# Altium schematic sheet Analogicas_Tension.SchDoc: Analogicas Tension
size A3; CompanyName: TM; DrawnBy: Juan Tinazzo; SheetNumber: 4; SheetTotal: 7; Number: CB_AT; Company: TM
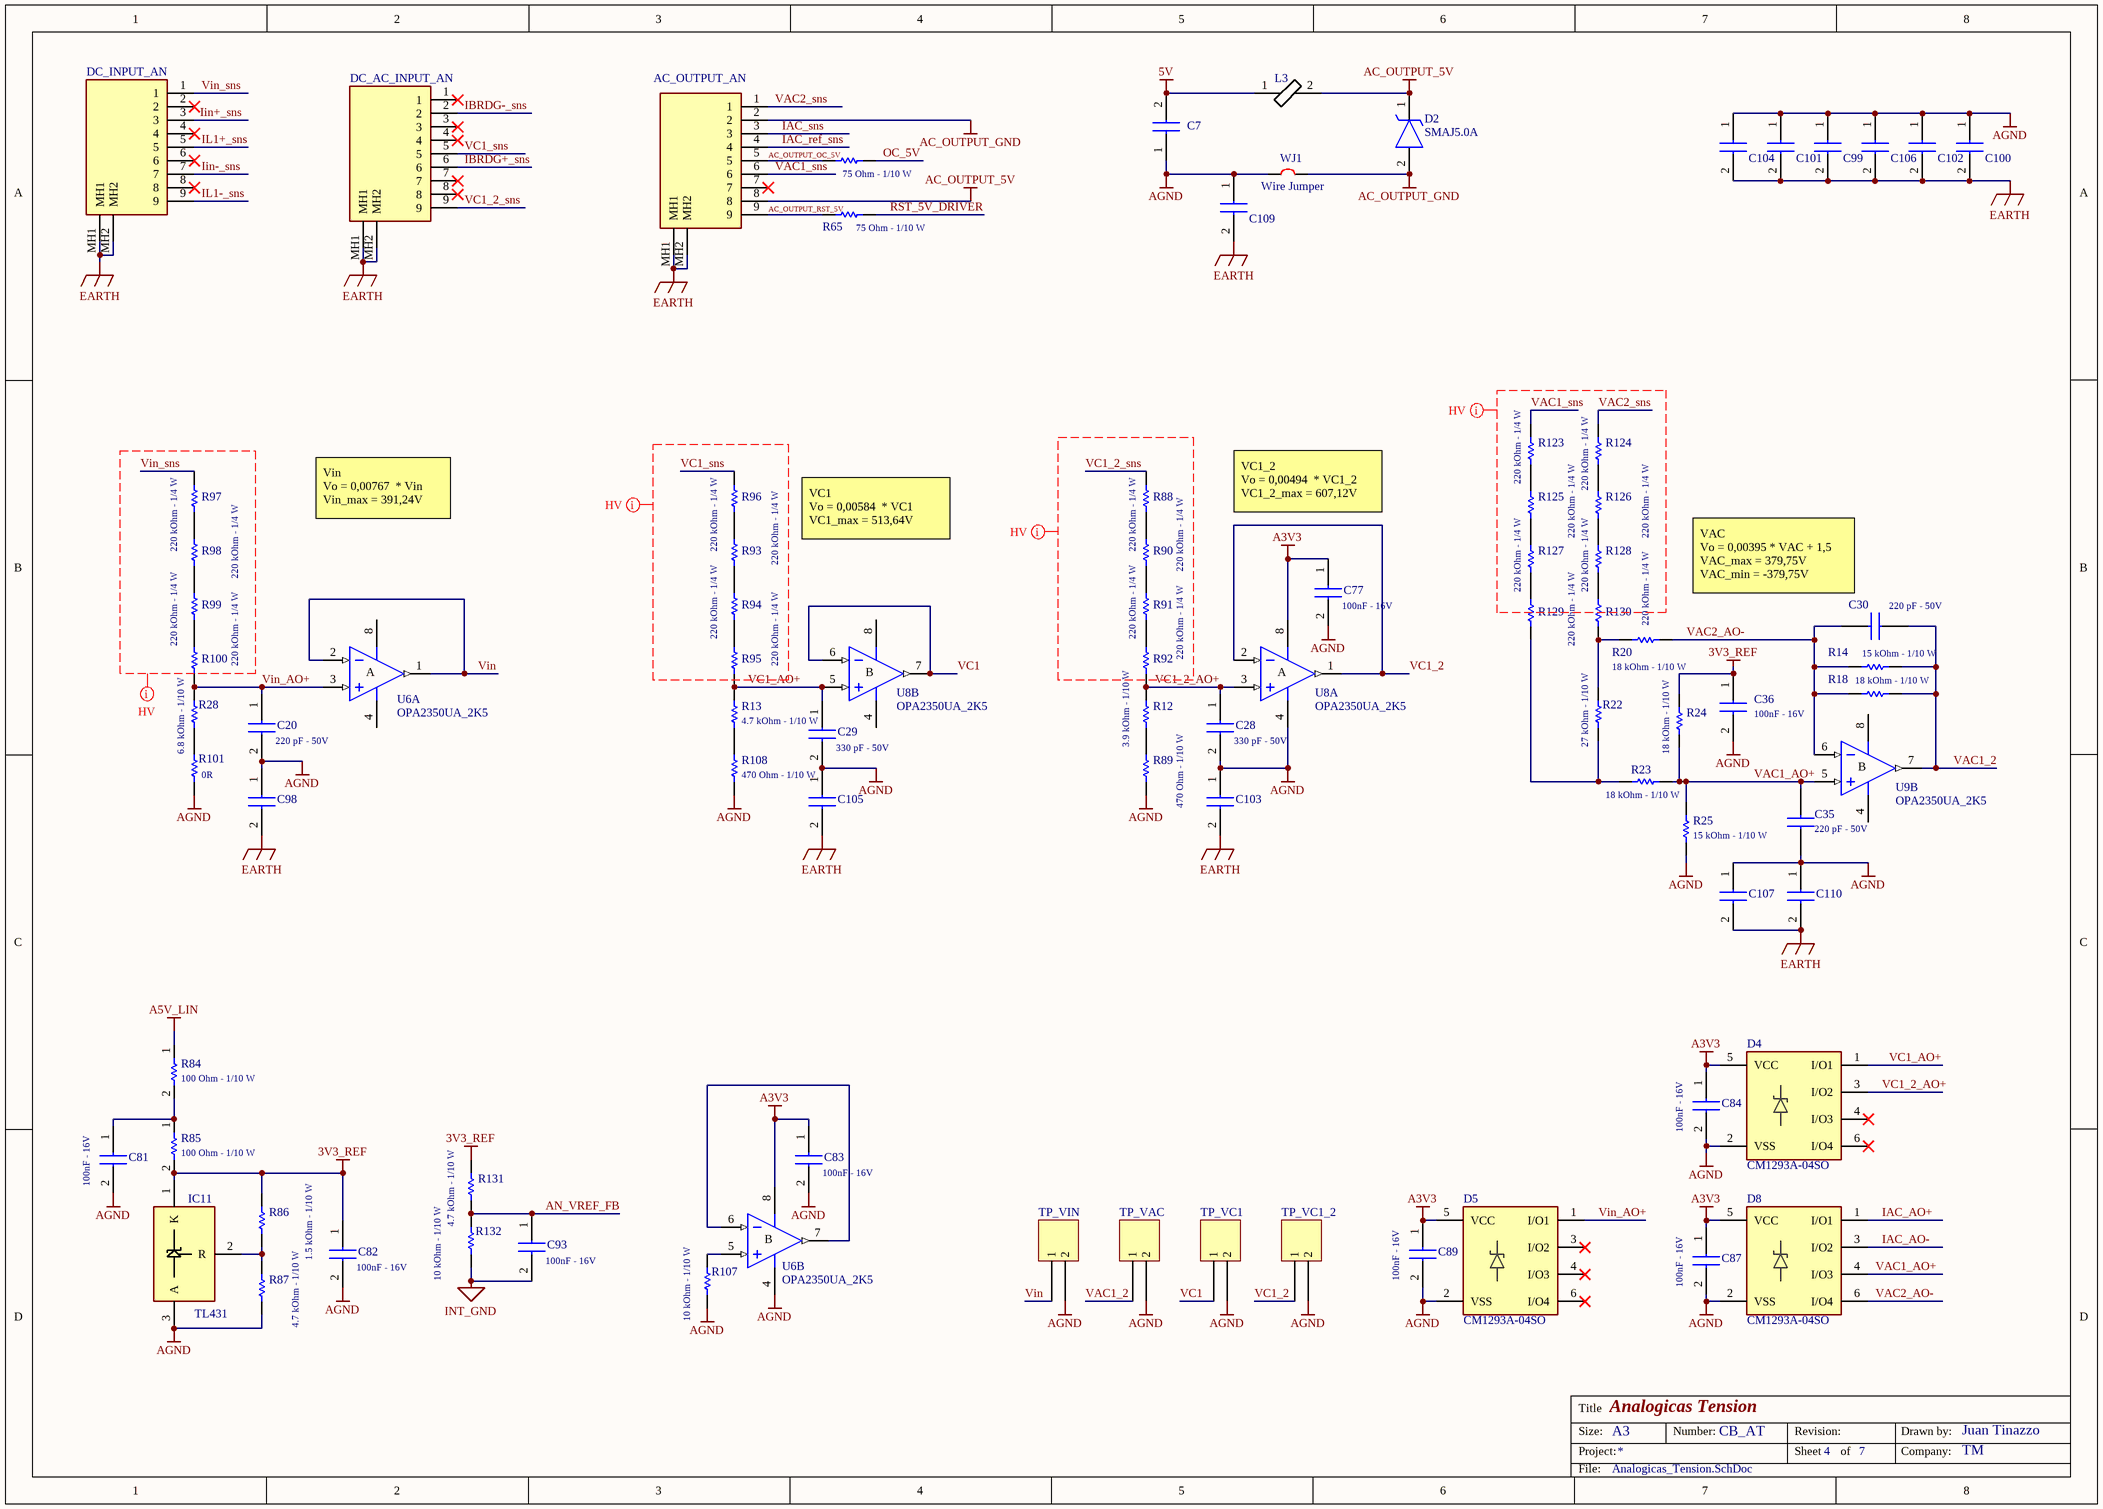
[diagram p0: Analogicas_Tension.SchDoc]

## Parts
AC_OUTPUT_AN  L77TSEH09SOL2RM8  [L77TSEH09SOL2RM8]  (value not drawn)
C7  CL21B105KAFNNNG  [CAPC2012X135N]  (value not drawn)
C20  value 220 pF - 50V  [C0603]  (hidden comment: 220p 50V 5% 0603)
C28  value 330 pF - 50V  [C0603]  (hidden comment: C0603C331J5GACAUTO)
C29  value 330 pF - 50V  [C0603]  (hidden comment: C0603C331J5GACAUTO)
C30  value 220 pF - 50V  [C0603]  (hidden comment: C0603C221J5HACAUTO)
C35  value 220 pF - 50V  [C0603]  (hidden comment: C0603C221J5HACAUTO)
C36  value 100nF - 16V  [CAPC1608X95N]  (hidden comment: 100n 16V 0603)
C77  value 100nF - 16V  [CAPC1608X95N]  (hidden comment: 100n 16V 0603)
C81  value 100nF - 16V  [CAPC1608X95N]  (hidden comment: 100n 16V 0603)
C82  value 100nF - 16V  [CAPC1608X95N]  (hidden comment: 100n 16V 0603)
C83  value 100nF - 16V  [CAPC1608X95N]  (hidden comment: 100n 16V 0603)
C84  value 100nF - 16V  [CAPC1608X95N]  (hidden comment: 100n 16V 0603)
C87  value 100nF - 16V  [CAPC1608X95N]  (hidden comment: 100n 16V 0603)
C89  value 100nF - 16V  [CAPC1608X95N]  (hidden comment: 100n 16V 0603)
C93  value 100nF - 16V  [CAPC1608X95N]  (hidden comment: 100n 16V 0603)
C98  LDEQD1100KA5N00  [C_2220_1206]  (value not drawn)
C99  C1206C102KGRACAUTO  [C1206]  (value not drawn)
C100  C1206C102KGRACAUTO  [C1206]  (value not drawn)
C101  C1206C102KGRACAUTO  [C1206]  (value not drawn)
C102  C1206C102KGRACAUTO  [C1206]  (value not drawn)
C103  LDEQD1100KA5N00  [C_2220_1206]  (value not drawn)
C104  C1206C102KGRACAUTO  [C1206]  (value not drawn)
C105  LDEQD1100KA5N00  [C_2220_1206]  (value not drawn)
C106  C1206C102KGRACAUTO  [C1206]  (value not drawn)
C107  LDEQD1100KA5N00  [C_2220_1206]  (value not drawn)
C109  LDEQD1100KA5N00  [C_2220_1206]  (value not drawn)
C110  LDEQD1100KA5N00  [C_2220_1206]  (value not drawn)
D2  SMAJ5.0A  [DIOM5026X229N]
D4  CM1293A-04SO  [SOT95P275X110-6N]
D5  CM1293A-04SO  [SOT95P275X110-6N]
D8  CM1293A-04SO  [SOT95P275X110-6N]
DC_AC_INPUT_AN  L77TSEH09SOL2RM8  [L77TSEH09SOL2RM8]  (value not drawn)
DC_INPUT_AN  L77TSEH09SOL2RM8  [L77TSEH09SOL2RM8]  (value not drawn)
IC11  TL431  [SOT95P237X112-3N]
L3  78279220601  [BEADC2012X110N]  (value not drawn)
R12  value 3.9 kOhm - 1/10 W  [RESC1608X50N]  (hidden comment: CRCW06033K90FKEA)
R13  value 4.7 kOhm - 1/10 W  [RESC1608X50N]  (hidden comment: CRCW06034K70FKEAHP)
R14  value 15 kOhm - 1/10 W  [RESC1608X55N]  (hidden comment: CRCW060315K0FKEAC)
R18  value 18 kOhm - 1/10 W  [RESC1608X50N]  (hidden comment: CRCW060318K0FKEA)
R20  value 18 kOhm - 1/10 W  [RESC1608X50N]  (hidden comment: CRCW060318K0FKEA)
R22  value 27 kOhm - 1/10 W  [RESC1608X55N]  (hidden comment: CRCW060327K0FKEAC)
R23  value 18 kOhm - 1/10 W  [RESC1608X50N]  (hidden comment: CRCW060318K0FKEA)
R24  value 18 kOhm - 1/10 W  [RESC1608X50N]  (hidden comment: CRCW060318K0FKEA)
R25  value 15 kOhm - 1/10 W  [RESC1608X55N]  (hidden comment: CRCW060315K0FKEAC)
R28  value 6.8 kOhm - 1/10 W  [RESC1608X50N]  (hidden comment: CRCW06036K80FKEA)
R62  value 75 Ohm - 1/10 W  [RESC1608X55N]  (hidden comment: CRCW060375R0FKEAC)
R65  value 75 Ohm - 1/10 W  [RESC1608X55N]  (hidden comment: CRCW060375R0FKEAC)
R84  value 100 Ohm - 1/10 W  [RESC1608X55N]  (hidden comment: CRCW0603100RFKEBC)
R85  value 100 Ohm - 1/10 W  [RESC1608X55N]  (hidden comment: CRCW0603100RFKEBC)
R86  value 1.5 kOhm - 1/10 W  [RESC1608X50N]  (hidden comment: CRCW06031K50FKEA)
R87  value 4.7 kOhm - 1/10 W  [RESC1608X50N]  (hidden comment: CRCW06034K70FKEAHP)
R88  value 220 kOhm - 1/4 W  [RESC3216X60N]  (hidden comment: CRCW1206220KFKEA)
R89  value 470 Ohm - 1/10 W  [RESC1608X50N]  (hidden comment: CRCW0603470RFKEA)
R90  value 220 kOhm - 1/4 W  [RESC3216X60N]  (hidden comment: CRCW1206220KFKEA)
R91  value 220 kOhm - 1/4 W  [RESC3216X60N]  (hidden comment: CRCW1206220KFKEA)
R92  value 220 kOhm - 1/4 W  [RESC3216X60N]  (hidden comment: CRCW1206220KFKEA)
R93  value 220 kOhm - 1/4 W  [RESC3216X60N]  (hidden comment: CRCW1206220KFKEA)
R94  value 220 kOhm - 1/4 W  [RESC3216X60N]  (hidden comment: CRCW1206220KFKEA)
R95  value 220 kOhm - 1/4 W  [RESC3216X60N]  (hidden comment: CRCW1206220KFKEA)
R96  value 220 kOhm - 1/4 W  [RESC3216X60N]  (hidden comment: CRCW1206220KFKEA)
R97  value 220 kOhm - 1/4 W  [RESC3216X60N]  (hidden comment: CRCW1206220KFKEA)
R98  value 220 kOhm - 1/4 W  [RESC3216X60N]  (hidden comment: CRCW1206220KFKEA)
R99  value 220 kOhm - 1/4 W  [RESC3216X60N]  (hidden comment: CRCW1206220KFKEA)
R100  value 220 kOhm - 1/4 W  [RESC3216X60N]  (hidden comment: CRCW1206220KFKEA)
R101  value 0R  [RESC1608X55N]  (hidden comment: CRCW06030000Z0EBC)
R107  value 10 kOhm - 1/10 W  [RESC1608X50N]  (hidden comment: CRCW060310K0FKEA)
R108  value 470 Ohm - 1/10 W  [RESC1608X50N]  (hidden comment: CRCW0603470RFKEA)
R123  value 220 kOhm - 1/4 W  [RESC3216X60N]  (hidden comment: CRCW1206220KFKEA)
R124  value 220 kOhm - 1/4 W  [RESC3216X60N]  (hidden comment: CRCW1206220KFKEA)
R125  value 220 kOhm - 1/4 W  [RESC3216X60N]  (hidden comment: CRCW1206220KFKEA)
R126  value 220 kOhm - 1/4 W  [RESC3216X60N]  (hidden comment: CRCW1206220KFKEA)
R127  value 220 kOhm - 1/4 W  [RESC3216X60N]  (hidden comment: CRCW1206220KFKEA)
R128  value 220 kOhm - 1/4 W  [RESC3216X60N]  (hidden comment: CRCW1206220KFKEA)
R129  value 220 kOhm - 1/4 W  [RESC3216X60N]  (hidden comment: CRCW1206220KFKEA)
R130  value 220 kOhm - 1/4 W  [RESC3216X60N]  (hidden comment: CRCW1206220KFKEA)
R131  value 4.7 kOhm - 1/10 W  [RESC1608X50N]  (hidden comment: CRCW06034K70FKEAHP)
R132  value 10 kOhm - 1/10 W  [RESC1608X50N]  (hidden comment: CRCW060310K0FKEA)
TP_VAC  Test_Point  [Test Point]  (value not drawn)
TP_VC1  Test_Point  [Test Point]  (value not drawn)
TP_VC1_2  Test_Point  [Test Point]  (value not drawn)
TP_VIN  Test_Point  [Test Point]  (value not drawn)
U6  OPA2350UA_2K5  [SOIC127P600X175-8N]  (parts A,B of 2)
U8  OPA2350UA_2K5  [SOIC127P600X175-8N]  (parts A,B of 2)
U9  OPA2350UA_2K5  [SOIC127P600X175-8N]  (part B of 2)
WJ1  Wire Jumper  (net tie, no BOM)

## Nets
3V3_REF: C36.1 C82.1 IC11.1(K) R24.2 R85.2 R86.1 R131.1
5V: C7.2 L3.1
A3V3: C77.1 C83.1 C84.1 C87.1 C89.1 D4.5(VCC) D5.5(VCC) D8.5(VCC) U6.8(V+) U8.8(V+)
A5V_LIN: R84.1
AC_OUTPUT_5V: AC_OUTPUT_AN.8 D2.1(K) L3.2
AC_OUTPUT_GND: AC_OUTPUT_AN.2 D2.2(A) WJ1.1
AGND: C7.1 C20.2 C28.2 C29.2 C35.2 C36.2 C77.2 C81.2 C82.2 C83.2 C84.2 C87.2 C89.2 C98.1 C99.1 C100.1 C101.1 C102.1 C103.1 C104.1 C105.1 C106.1 C107.1 C109.1 C110.1 D4.2(VSS) D5.2(VSS) D8.2(VSS) IC11.3(A) R25.2 R87.2 R89.2 R101.1 R107.1 R108.2 TP_VAC.2 TP_VC1.2 TP_VC1_2.2 TP_VIN.2 U6.4(V-) U8.4(V-) WJ1.0
EARTH: AC_OUTPUT_AN.MH1 AC_OUTPUT_AN.MH2 C98.2 C99.2 C100.2 C101.2 C102.2 C103.2 C104.2 C105.2 C106.2 C107.2 C109.2 C110.2 DC_AC_INPUT_AN.MH1 DC_AC_INPUT_AN.MH2 DC_INPUT_AN.MH1 DC_INPUT_AN.MH2
INT_GND: C93.2 R132.2
AC_OUTPUT_OC_5V: AC_OUTPUT_AN.5 R62.1
AC_OUTPUT_RST_5V: AC_OUTPUT_AN.9 R65.1
AN_VREF_FB: C93.1 R131.2 R132.1
IAC_AO+: D8.1(I/O1)
IAC_AO-: D8.3(I/O2)
IAC_ref_sns: AC_OUTPUT_AN.4
IAC_sns: AC_OUTPUT_AN.3
IBRDG+_sns: DC_AC_INPUT_AN.6
IBRDG-_sns: DC_AC_INPUT_AN.2
Iin+_sns: DC_INPUT_AN.3
Iin-_sns: DC_INPUT_AN.7
IL1+_sns: DC_INPUT_AN.5
IL1-_sns: DC_INPUT_AN.9
OC_5V: R62.2
RST_5V_DRIVER: R65.2
VAC1_2: C30.1 R14.2 R18.2 TP_VAC.1 U9.7(OUT)
VAC1_AO+: C35.1 D8.4(I/O3) R23.1 R24.1 R25.1 U9.5(IN+)
VAC1_sns: AC_OUTPUT_AN.6 R123.2
VAC2_AO-: C30.2 D8.6(I/O4) R14.1 R18.1 R20.1 U9.6(IN-)
VAC2_sns: AC_OUTPUT_AN.1 R124.2
VC1: TP_VC1.1 U8.6(IN-) U8.7(OUT)
VC1_2: TP_VC1_2.1 U8.1(OUT) U8.2(IN-)
VC1_2_AO+: C28.1 D4.3(I/O2) R12.2 R92.1 U8.3(IN+)
VC1_2_sns: DC_AC_INPUT_AN.9 R88.2
VC1_AO+: C29.1 D4.1(I/O1) R13.2 R95.1 U8.5(IN+)
VC1_sns: DC_AC_INPUT_AN.5 R96.2
Vin: TP_VIN.1 U6.1(OUT) U6.2(IN-)
Vin_AO+: C20.1 D5.1(I/O1) R28.2 R100.1 U6.3(IN+)
Vin_sns: DC_INPUT_AN.1 R97.2
NetC81_1: C81.1 R84.2 R85.1
NetIC11_2: IC11.2(R) R86.2 R87.1
NetR12_1: R12.1 R89.1
NetR13_1: R13.1 R108.1
NetR20_2: R20.2 R22.2 R130.1
NetR22_1: R22.1 R23.2 R129.1
NetR28_1: R28.1 R101.2
NetR88_1: R88.1 R90.2
NetR90_1: R90.1 R91.2
NetR91_1: R91.1 R92.2
NetR93_1: R93.1 R94.2
NetR93_2: R93.2 R96.1
NetR94_1: R94.1 R95.2
NetR97_1: R97.1 R98.2
NetR98_1: R98.1 R99.2
NetR99_1: R99.1 R100.2
NetR107_2: R107.2 U6.5(IN+)
NetR123_1: R123.1 R125.2
NetR124_1: R124.1 R126.2
NetR125_1: R125.1 R127.2
NetR126_1: R126.1 R128.2
NetR127_1: R127.1 R129.2
NetR128_1: R128.1 R130.2
NetU6_6: U6.6(IN-) U6.7(OUT)

Not connected (* = marked no-connect by the designer): AC_OUTPUT_AN 7*; D4 4(I/O3)* 6(I/O4)*; D5 3(I/O2)* 4(I/O3)* 6(I/O4)*; DC_AC_INPUT_AN 1* 3* 4* 7* 8*; DC_INPUT_AN 2* 4* 6* 8*; U9 4(V-) 8(V+)

## Layout directives
net class HV_track: VAC1_sns, VAC2_sns, VC1_2_sns, VC1_sns, Vin_sns

## Notes on the sheet
- Vin
  Vo = 0,00767  * Vin
  Vin_max = 391,24V
- VC1_2
  Vo = 0,00494  * VC1_2
  VC1_2_max = 607,12V
- VC1
  Vo = 0,00584  * VC1
  VC1_max = 513,64V
- VAC
  Vo = 0,00395 * VAC + 1,5
  VAC_max = 379,75V
  VAC_min = -379,75V
- Title
- Size:
- Project:
- A3
- Number:
- Revision:
- Sheet
- of
- Drawn by:
- Company:
- File:
- (in symbol OPA2350UA_2K5, part A) A
- (in symbol OPA2350UA_2K5, part B) B

## Library data of the parts
AC_OUTPUT_AN DC_AC_INPUT_AN DC_INPUT_AN = L77TSEH09SOL2RM8: Connector; Manufacturer_Name: Amphenol Communications Solutions; Value: Conectores estándar subminiatura D D-SUB; Datasheet Link: https://cdn.amphenol-cs.com/media/wysiwyg/files/drawing/l77tsxhxxsol2rm8.pdf; Height: 12.3mm; Manufacturer_Part_Number: L77TSEH09SOL2RM8; Mouser Part Number: 523-L77TSEH09SOL2RM8; Mouser Price/Stock: https://www.mouser.co.uk/ProductDetail/Amphenol-Commercial-Products/L77TSEH09SOL2RM8?qs=mq7kV%2Fq8lk5RvjourI%2Fduw%3D%3D; Arrow Part Number: L77TSEH09SOL2RM8; Arrow Price/Stock: https://www.arrow.com/en/products/l77tseh09sol2rm8/amphenol-fci?region=nac; System: Connector
C7 = CL21B105KAFNNNG: Capacitor; Manufacturer_Name: SAMSUNG; Value: 1 uF - 25 V; Datasheet Link: https://datasheet.datasheetarchive.com/originals/distributors/Datasheets-DGA8/2478773.pdf; Height: 1.35mm; Manufacturer_Part_Number: CL21B105KAFNNNG; Mouser Part Number: 187-CL21B105KAFNNNG; Mouser Price/Stock: https://www.mouser.co.uk/ProductDetail/Samsung-Electro-Mechanics/CL21B105KAFNNNG?qs=yOVawPpwOwmXkU%252BG0TK%2F5g%3D%3D; Arrow Part Number: CL21B105KAFNNNG; Arrow Price/Stock: https://www.arrow.com/en/products/cl21b105kafnnng/samsung-electro-mechanics?region=europe
C20 C30 C35 = C0603C221J5HACAUTO: Capacitor; Manufacturer_Name: KEMET; Datasheet Link: https://content.kemet.com/datasheets/KEM_C1007_X8R_ULTRA_150C_SMD.pdf; Height: 0.87mm; Manufacturer_Part_Number: C0603C221J5HACAUTO; Mouser Part Number: 80-C0603C221J5HAUTO; Mouser Price/Stock: https://www.mouser.co.uk/ProductDetail/KEMET/C0603C221J5HACAUTO?qs=j%252B1pi9TdxUZayjzZ3rh80g%3D%3D
C28 C29 = C0603C331J5GACAUTO: Capacitor; Manufacturer_Name: KEMET; Datasheet Link: https://content.kemet.com/datasheets/KEM_C1022_C0G_AUTO_SMD.pdf; Height: 0.87mm; Manufacturer_Part_Number: C0603C331J5GACAUTO; Mouser Part Number: 80-C0603C331J5GAUTO
C36 C77 C81-C84 C87 C89 C93 = EMK107B7104KA-T: Capacitor; Manufacturer_Name: TAIYO YUDEN; Datasheet Link: http://www.farnell.com/datasheets/746258.pdf; Height: 0.95mm; Manufacturer_Part_Number: EMK107B7104KA-T; Mouser Part Number: 963-EMK107B7104KA-T; Arrow Part Number: EMK107B7104KA-T; Arrow Price/Stock: https://www.arrow.com/en/products/emk107b7104ka-t/taiyo-yuden
  C36: Mouser Price/Stock: https://www.mouser.co.uk/ProductDetail/TAIYO-YUDEN/EMK107B7104KA-T?qs=I6KAKw0tg2ybqzX8hKPgfw%3D%3D
  C77 C81-C84 C87 C89 C93: Mouser Price/Stock: https://www.mouser.co.uk/ProductDetail/Taiyo-Yuden/EMK107B7104KA-T?qs=I6KAKw0tg2ybqzX8hKPgfw%3D%3D
C98 C103 C105 C107 C109 C110 = LDEQD1100KA5N00: Capacitor; Manufacturer_Name: KEMET; Value: 1nF - 1000V; Datasheet Link: https://content.kemet.com/datasheets/KEM_F3078_LDE.pdf; Height: 1.9mm; Manufacturer_Part_Number: LDEQD1100KA5N00; Mouser Part Number: 80-LDEQD1100KA5N00; Mouser Price/Stock: https://www.mouser.co.uk/ProductDetail/KEMET/LDEQD1100KA5N00?qs=MdJgNetHbfkxq2yA6XdGCw%3D%3D
C99-C102 C104 C106 = C1206C102KGRACAUTO: Capacitor; Manufacturer_Name: KEMET; Value: 1nF - 2000V; Datasheet Link: https://content.kemet.com/datasheets/KEM_C1076_X7R_HV_AUTO_SMD.pdf; Manufacturer_Part_Number: C1206C102KGRACAUTO; Mouser Part Number: 80-C1206C102KGRAUTO; Mouser Price/Stock: https://www.mouser.co.uk/ProductDetail/KEMET/C1206C102KGRACAUTO?qs=02kMkzikyGKenJNcwYLRQw%3D%3D; Arrow Part Number: C1206C102KGRACAUTO; Arrow Price/Stock: https://www.arrow.com/en/products/c1206c102kgracauto/kemet-corporation?region=nac
D2 = SMAJ5.0A: TVS Diode (Uni-directional); Manufacturer_Name: LITTELFUSE; Value: 1CH - Unidireccional - 5V - 3.3 W; Datasheet Link: https://www.littelfuse.com/~/media/electronics/datasheets/tvs_diodes/littelfuse_tvs_diode_smaj_datasheet.pdf.pdf; Height: 2.29mm; Manufacturer_Part_Number: SMAJ5.0A; Mouser Part Number: 576-SMAJ5.0A; Mouser Price/Stock: https://www.mouser.co.uk/ProductDetail/Littelfuse/SMAJ5.0A?qs=2VFNtWizgicfetZVA4gWHA%3D%3D; Arrow Part Number: SMAJ5.0A; Arrow Price/Stock: https://www.arrow.com/en/products/smaj5.0a/littelfuse?region=europe
D4 D5 D8 = CM1293A-04SO: TVS Diode (Bi-directional); Manufacturer_Name: onsemi; Manufacturer_Part_Number: D5V0P4UR6SO-7; Value: 4CH - Unidireccional - 3.3V - 800mW; Datasheet Link: https://www.onsemi.com/pub/Collateral/CM1293A-04SO-D.PDF; Height: 1.1mm; Mouser Part Number: 748-CM1293A-04SO; Mouser Price/Stock: https://www.mouser.co.uk/ProductDetail/onsemi/CM1293A-04SO?qs=LMMkZCEv%2Ff0mlcOKTEwKBg%3D%3D; Arrow Part Number: CM1293A-04SO; Arrow Price/Stock: https://www.arrow.com/en/products/cm1293a-04so/on-semiconductor?region=nac
IC11 = TL431LIBEDBZRQ1: Integrated Circuit; Manufacturer_Name: Texas Instruments; Value: Referencias de voltaje; Datasheet Link: https://www.ti.com/lit/gpn/TL431LI-Q1; Height: 1.12mm; Manufacturer_Part_Number: TL431LIBEDBZRQ1; Mouser Part Number: 595-TL431LIBEDBZRQ1; Mouser Price/Stock: https://www.mouser.co.uk/ProductDetail/Texas-Instruments/TL431LIBEDBZRQ1?qs=Cb2nCFKsA8oDEduucTTYNA%3D%3D; Arrow Part Number: TL431LIBEDBZRQ1; Arrow Price/Stock: https://www.arrow.com/en/products/tl431libedbzrq1/texas-instruments?region=nac
L3 = 78279220601: Ferrite Bead; Manufacturer_Name: Wurth Elektronik; Value: Núcleos de ferrita WE-MPSA EMI 600Ohms 2.1A 80mOhms; Datasheet Link: https://www.mouser.de/datasheet/2/445/78279220601-2298574.pdf; Height: 1.1mm; Manufacturer_Part_Number: 78279220601; Mouser Part Number: 710-78279220601; Mouser Price/Stock: https://www.mouser.co.uk/ProductDetail/Wurth-Elektronik/78279220601?qs=iLbezkQI%252BsjgiK1FovJqGg%3D%3D
R12 = CRCW06033K90FKEA: Resistor; Manufacturer_Name: Vishay; Datasheet Link: http://www.vishay.com/docs/20035/dcrcwe3.pdf; Height: 0.5mm; Manufacturer_Part_Number: CRCW06033K90FKEA; Mouser Part Number: 71-CRCW0603-3.9K-E3; Mouser Price/Stock: https://www.mouser.com/Search/Refine.aspx?Keyword=71-CRCW0603-3.9K-E3; Arrow Part Number: CRCW06033K90FKEA; Arrow Price/Stock: https://www.arrow.com/en/products/crcw06033k90fkea/vishay
R13 R87 R131 = CRCW06034K70FKEAHP: Resistor; Manufacturer_Name: Vishay; Datasheet Link: http://www.farnell.com/datasheets/1885357.pdf; Height: 0.5mm; Manufacturer_Part_Number: CRCW06034K70FKEAHP; Mouser Part Number: 71-CRCW06034K70FKEAH; Mouser Price/Stock: https://www.mouser.co.uk/ProductDetail/Vishay-Dale/CRCW06034K70FKEAHP?qs=k2%2FDWSARqgF9tclCHvhGkQ%3D%3D; Arrow Part Number: CRCW06034K70FKEAHP; Arrow Price/Stock: https://www.arrow.com/en/products/crcw06034k70fkeahp/vishay?region=nac
R14 R25 = CRCW060315K0FKEAC: Resistor; Manufacturer_Name: Vishay; Datasheet Link: https://www.arrow.com/en/products/crcw060315k0fkeac/vishay; Height: 0.55mm; Manufacturer_Part_Number: CRCW060315K0FKEAC; Mouser Part Number: 71-CRCW060315K0FKEAC; Mouser Price/Stock: https://www.mouser.co.uk/ProductDetail/Vishay-Dale/CRCW060315K0FKEAC?qs=E3Y5ESvWgWOCeZLgjE8pIw%3D%3D; Arrow Part Number: CRCW060315K0FKEAC; Arrow Price/Stock: https://www.arrow.com/en/products/crcw060315k0fkeac/vishay?region=nac
R18 R20 R23 R24 = CRCW060318K0FKEA: Resistor; Manufacturer_Name: Vishay; Datasheet Link: http://www.vishay.com/docs/20035/dcrcwe3.pdf; Height: 0.5mm; Manufacturer_Part_Number: CRCW060318K0FKEA; Mouser Part Number: 71-CRCW0603-18K-E3; Mouser Price/Stock: https://www.mouser.co.uk/ProductDetail/Vishay-Dale/CRCW060318K0FKEA?qs=Ihd9YkxhV%2F2Qiuqr%2FyuzaQ%3D%3D; Arrow Part Number: CRCW060318K0FKEA; Arrow Price/Stock: https://www.arrow.com/en/products/crcw060318k0fkea/vishay?region=nac
R22 = CRCW060327K0FKEAC: Resistor; Manufacturer_Name: Vishay; Datasheet Link: https://www.arrow.com/en/products/crcw060327k0fkeac/vishay; Height: 0.55mm; Manufacturer_Part_Number: CRCW060327K0FKEAC; Mouser Part Number: 71-CRCW060327K0FKEAC; Mouser Price/Stock: https://www.mouser.co.uk/ProductDetail/Vishay-Dale/CRCW060327K0FKEAC?qs=E3Y5ESvWgWP9bkV7w8gJXg%3D%3D; Arrow Part Number: CRCW060327K0FKEAC; Arrow Price/Stock: https://www.arrow.com/en/products/crcw060327k0fkeac/vishay?region=nac
R28 = CRCW06036K80FKEA: Resistor; Manufacturer_Name: Vishay; Datasheet Link: http://www.vishay.com/docs/20035/dcrcwe3.pdf; Height: 0.5mm; Manufacturer_Part_Number: CRCW06036K80FKEA; Mouser Part Number: 71-CRCW0603-6.8K-E3; Mouser Price/Stock: https://www.mouser.co.uk/ProductDetail/Vishay-Dale/CRCW06036K80FKEA?qs=AJ8X0UdFcuT%2FTCHOUTZCrw%3D%3D; Arrow Part Number: CRCW06036K80FKEA; Arrow Price/Stock: https://www.arrow.com/en/products/crcw06036k80fkea/vishay
R62 R65 = CRCW060375R0FKEAC: Resistor; Manufacturer_Name: Vishay; Datasheet Link: https://www.arrow.com/en/products/crcw060375r0fkeac/vishay; Height: 0.55mm; Manufacturer_Part_Number: CRCW060375R0FKEAC; Mouser Part Number: 71-CRCW060375R0FKEAC; Mouser Price/Stock: https://www.mouser.co.uk/ProductDetail/Vishay-Dale/CRCW060375R0FKEAC?qs=E3Y5ESvWgWPOxF9wqCfv4A%3D%3D; Arrow Part Number: CRCW060375R0FKEAC; Arrow Price/Stock: https://www.arrow.com/en/products/crcw060375r0fkeac/vishay?region=nac
R84 R85 = CRCW0603100RFKEBC: Resistor; Manufacturer_Name: Vishay; Datasheet Link: https://www.vishay.com/docs/28773/crcwce3.pdf; Height: 0.55mm; Manufacturer_Part_Number: CRCW0603100RFKEBC; Mouser Part Number: 71-CRCW0603100RFKEBC; Mouser Price/Stock: https://www.mouser.co.uk/ProductDetail/Vishay-Dale/CRCW0603100RFKEBC?qs=wd5RIQLrsJhdvQFtBw4oWg%3D%3D; Arrow Part Number: CRCW0603100RFKEBC; Arrow Price/Stock: https://www.arrow.com/en/products/crcw0603100rfkebc/vishay?region=nac
R86 = CRCW06031K50FKEA: Resistor; Manufacturer_Name: Vishay; Datasheet Link: http://www.vishay.com/docs/20035/dcrcwe3.pdf; Height: 0.5mm; Manufacturer_Part_Number: CRCW06031K50FKEA; Mouser Part Number: 71-CRCW0603-1.5K-E3; Mouser Price/Stock: https://www.mouser.co.uk/ProductDetail/Vishay-Dale/CRCW06031K50FKEA?qs=TPnjyyNsHsazZOiw0hmO4g%3D%3D; Arrow Part Number: CRCW06031K50FKEA; Arrow Price/Stock: https://www.arrow.com/en/products/crcw06031k50fkea/vishay?region=nac
R88 R90-R100 R123-R130 = CRCW1206220KFKEA: Resistor; Manufacturer_Name: Vishay; Datasheet Link: http://www.vishay.com/docs/20035/dcrcwe3.pdf; Height: 0.6mm; Manufacturer_Part_Number: CRCW1206220KFKEA; Mouser Part Number: 71-CRCW1206-220K-E3; Mouser Price/Stock: https://www.mouser.co.uk/ProductDetail/Vishay-Dale/CRCW1206220KFKEA?qs=bSMkur10BccuQYiNrhxgBA%3D%3D
R89 R108 = CRCW0603470RFKEA: Resistor; Manufacturer_Name: Vishay; Datasheet Link: http://www.vishay.com/docs/20035/dcrcwe3.pdf; Height: 0.5mm; Manufacturer_Part_Number: CRCW0603470RFKEA; Mouser Part Number: 71-CRCW0603-470-E3; Mouser Price/Stock: https://www.mouser.co.uk/ProductDetail/Vishay-Dale/CRCW0603470RFKEA?qs=2LLIXXYaQepTa3IToKeExA%3D%3D; Arrow Part Number: CRCW0603470RFKEA; Arrow Price/Stock: https://www.arrow.com/en/products/crcw0603470rfkea/vishay
R101 = CRCW06030000Z0EBC: Resistor; Manufacturer_Name: Vishay; Datasheet Link: https://datasheet.datasheetarchive.com/originals/distributors/DKDS41/DSANUWW0030149.pdf; Height: 0.55mm; Manufacturer_Part_Number: CRCW06030000Z0EBC; Mouser Part Number: 71-CRCW06030000Z0EBC; Mouser Price/Stock: https://www.mouser.co.uk/ProductDetail/Vishay-Dale/CRCW06030000Z0EBC?qs=wd5RIQLrsJgQzOqdcVum5Q%3D%3D; Arrow Part Number: CRCW06030000Z0EBC; Arrow Price/Stock: https://www.arrow.com/en/products/crcw06030000z0ebc/vishay?region=nac
R107 R132 = CRCW060310K0FKEA: Resistor; Manufacturer_Name: Vishay; Datasheet Link: http://www.vishay.com/docs/20035/dcrcwe3.pdf; Height: 0.5mm; Manufacturer_Part_Number: CRCW060310K0FKEA; Mouser Part Number: 71-CRCW0603-10K-E3; Mouser Price/Stock: https://www.mouser.co.uk/ProductDetail/Vishay-Dale/CRCW060310K0FKEA?qs=pAO1Z172M84BVnhDjtnsoQ%3D%3D; Arrow Part Number: CRCW060310K0FKEA; Arrow Price/Stock: https://www.arrow.com/en/products/crcw060310k0fkea/vishay?region=nac
TP_VAC TP_VC1 TP_VC1_2 TP_VIN = Test_Point: Punta Prueba Osciloscopio; Manufacturer_Part_Number: PCB; Value: TP
U6 U8 U9 = OPA2350UA_2K5: Integrated Circuit; Manufacturer_Name: Texas Instruments; Manufacturer_Part_Number: OPA2350UA/2K5; Value: AO de alta velocidad, fuente unica, rail to rail; Datasheet Link: http://www.ti.com/lit/gpn/opa2350; Height: 1.75mm; Mouser Part Number: 595-OPA2350UA/2K5; Mouser Price/Stock: https://www.mouser.co.uk/ProductDetail/Texas-Instruments/OPA2350UA-2K5?qs=7nS3%252BbEUL6t75JUF5jEhbw%3D%3D; Arrow Part Number: OPA2350UA/2K5; Arrow Price/Stock: https://www.arrow.com/en/products/opa2350ua2k5/texas-instruments?region=nac
WJ1 = Wire Jumper: Manufacturer_Part_Number: Wire